# Altium schematic sheet ETHERNET.SchDoc
size A4; SheetNumber: 8; SheetTotal: 11
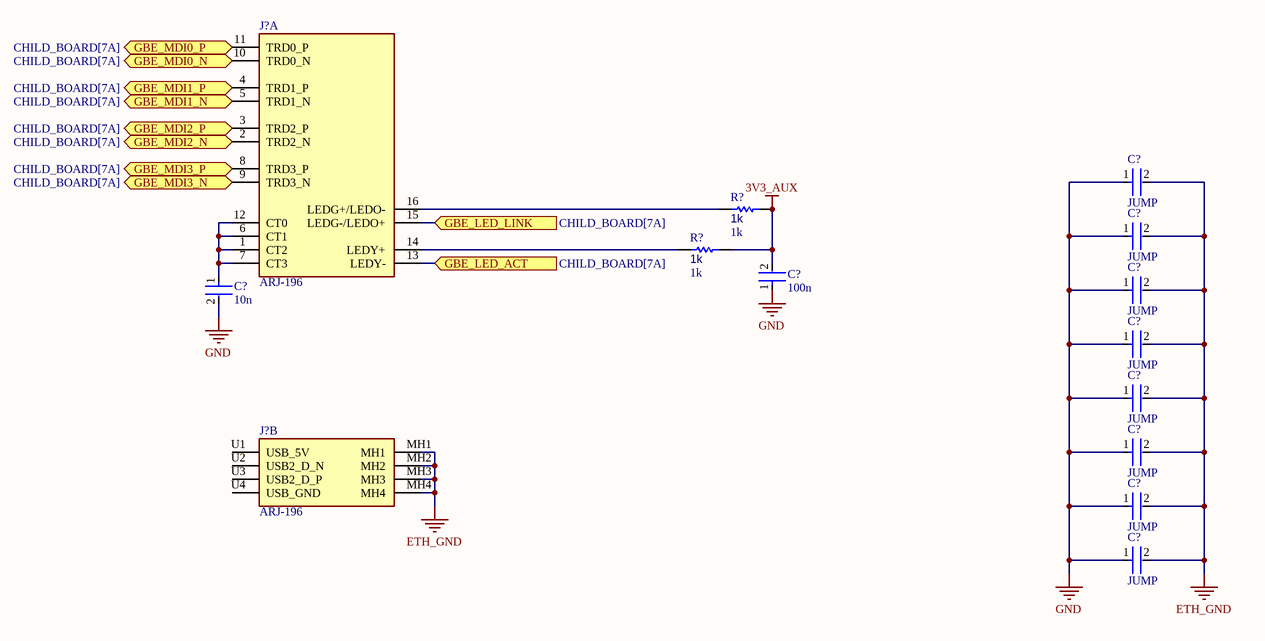
[diagram p0: ETHERNET.SchDoc]

## Parts
(Parts that share a designator on the sheet are numbered #1, #2 ... from top to bottom, then left to right.)
C?#1  JUMP  [FP-0402-L_1_0_0_05-W_0_5-IPC_A]
C?#2  JUMP  [FP-0402-L_1_0_0_05-W_0_5-IPC_A]
C?#3  10n  [FP-0402-L_1_0_0_05-W_0_5-IPC_A]
C?#4  100n  [FP-0402-L_1_0_0_05-W_0_5-IPC_A]
C?#5  JUMP  [FP-0402-L_1_0_0_05-W_0_5-IPC_A]
C?#6  JUMP  [FP-0402-L_1_0_0_05-W_0_5-IPC_A]
C?#7  JUMP  [FP-0402-L_1_0_0_05-W_0_5-IPC_A]
C?#8  JUMP  [FP-0402-L_1_0_0_05-W_0_5-IPC_A]
C?#9  JUMP  [FP-0402-L_1_0_0_05-W_0_5-IPC_A]
C?#10  JUMP  [FP-0402-L_1_0_0_05-W_0_5-IPC_A]
J?#1  ARJ-196  [ARJ-196-Footprint-1]  (part A of 2)
J?#2  ARJ-196  [ARJ-196-Footprint-1]  (part B of 2)
R?#1  1k  [R0603B]
R?#2  1k  [R0603B]

## Ports
GBE_LED_ACT (in, see CHILD_BOARD[7A]), GBE_LED_LINK (in, see CHILD_BOARD[7A]), GBE_MDI0_N (bidir, see CHILD_BOARD[7A]), GBE_MDI0_P (bidir, see CHILD_BOARD[7A]), GBE_MDI1_N (bidir, see CHILD_BOARD[7A]), GBE_MDI1_P (bidir, see CHILD_BOARD[7A]), GBE_MDI2_N (bidir, see CHILD_BOARD[7A]), GBE_MDI2_P (bidir, see CHILD_BOARD[7A]), GBE_MDI3_N (bidir, see CHILD_BOARD[7A]), GBE_MDI3_P (bidir, see CHILD_BOARD[7A])

## Nets
3V3_AUX: C?#4.2 R?#1.1 R?#2.1
ETH_GND: C?#1.2 C?#2.2 C?#5.2 C?#6.2 C?#7.2 C?#8.2 C?#9.2 C?#10.2 J?#2.MH1 J?#2.MH2 J?#2.MH3 J?#2.MH4
GND: C?#1.1 C?#2.1 C?#3.2 C?#4.1 C?#5.1 C?#6.1 C?#7.1 C?#8.1 C?#9.1 C?#10.1
GBE_LED_ACT: J?#1.13(LEDY-) ; port GBE_LED_ACT
GBE_LED_LINK: J?#1.15(LEDG-/LEDO+) ; port GBE_LED_LINK
GBE_MDI0_N: J?#1.10(TRD0_N) ; port GBE_MDI0_N
GBE_MDI0_P: J?#1.11(TRD0_P) ; port GBE_MDI0_P
GBE_MDI1_N: J?#1.5(TRD1_N) ; port GBE_MDI1_N
GBE_MDI1_P: J?#1.4(TRD1_P) ; port GBE_MDI1_P
GBE_MDI2_N: J?#1.2(TRD2_N) ; port GBE_MDI2_N
GBE_MDI2_P: J?#1.3(TRD2_P) ; port GBE_MDI2_P
GBE_MDI3_N: J?#1.9(TRD3_N) ; port GBE_MDI3_N
GBE_MDI3_P: J?#1.8(TRD3_P) ; port GBE_MDI3_P
NetC?#3_1: C?#3.1 J?#1.1(CT2) J?#1.6(CT1) J?#1.7(CT3) J?#1.12(CT0)
NetJ?#1_14: J?#1.14(LEDY+) R?#2.2
NetJ?#1_16: J?#1.16(LEDG+/LEDO-) R?#1.2

Not connected (* = marked no-connect by the designer): J?#2 U1(USB_5V) U2(USB2_D_N) U3(USB2_D_P) U4(USB_GND)

## Library data of the parts
C?#1-C?#10 = CMP-001-00058-1: LARGE PADS, 0402 CAP, CHANGE COMMENT TO MATCH REAL P/N; Capacitor Type: Ceramic; Min Operating Temperature: -55°C; Mounting Technology: Surface Mount; Pins: 2; Case/Package: 0402; RoHS Compliant: Yes; Max Operating Temperature: 85°C
J?#1 J?#2 = CMP-002-00092-1: Modular Connectors / Ethernet Connectors CONN MAGJACK 1PORT 1000 BASE-T; Connector Type: RJ45, USB; Max Operating Temperature: 85°C; Mounting Technology: Through Hole; Min Operating Temperature: -40°C
R?#1 R?#2 = CMP-009-00002-14: Resistor; Value: 1k